# EAGLE schematic termostat_ETHERNET (EAGLE 9.0.1)
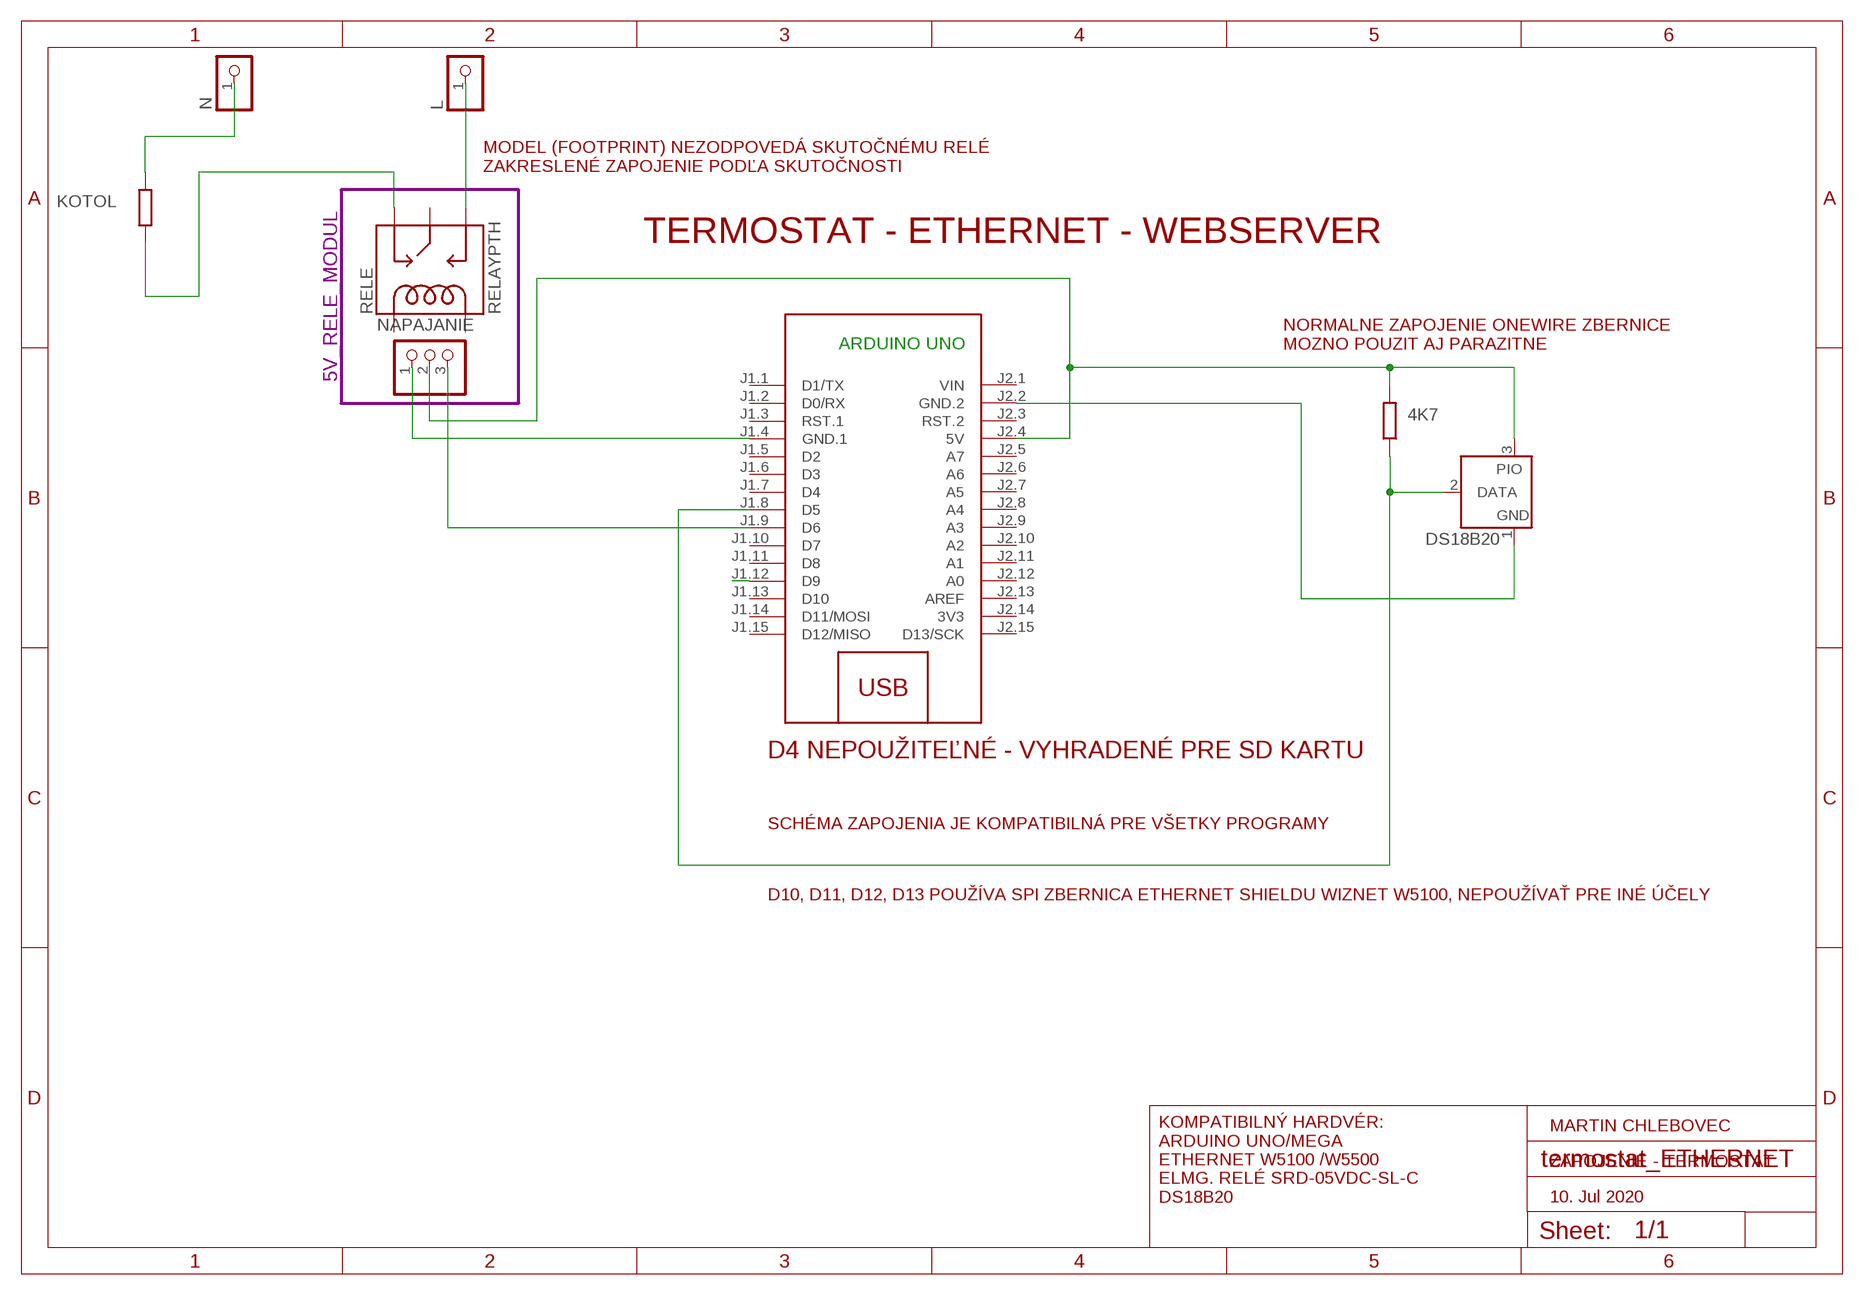
[diagram p0: schematic, sheet 1]

## Parts
IC1  DS2405  [TO92-]
L  PINHD-1X1CB  [1X01-CLEANBIG]
M1  ARDUINO-NANO-3.0  [ARDUINO-NANO-3.0]
N  PINHD-1X1CB  [1X01-CLEANBIG]
NAPAJANIE  PINHD-1X3  [1X03]
RELE  RELAYPTH  [SRD-05VDC-SL-C]

## Module instances
5V_RELE_MODUL = RELE

## Nets
N$3: IC1.1(GND) M1.J2.2(GND.2)
N$5: M1.J1.4(GND.1) NAPAJANIE.1
N$6: M1.J1.12(D9)
N$8: IC1.2(DATA) M1.J1.8(D5)
N$9: IC1.3(PIO) M1.J2.4(5V) NAPAJANIE.2
N$11: L.1 RELE.SWOPEN
N$12: N.1
N$13: RELE.SWCLOSED(SWCLOSE)
N$14: M1.J1.9(D6) NAPAJANIE.3
Unconnected: M1.J1.1(D1/TX) M1.J1.2(D0/RX) M1.J1.3(RST.1) M1.J1.5(D2) M1.J1.6(D3) M1.J1.7(D4) M1.J1.10(D7) M1.J1.11(D8) M1.J1.13(D10) M1.J1.14(D11/MOSI) M1.J1.15(D12/MISO) M1.J2.3(RST.2) M1.J2.5(A7) M1.J2.6(A6) M1.J2.7(A5) M1.J2.8(A4) M1.J2.9(A3) M1.J2.10(A2) M1.J2.11(A1) M1.J2.12(A0) M1.J2.13(AREF) M1.J2.15(D13/SCK) RELE.COIL0 RELE.COIL1 RELE.SWCOMMON

## Notes on the sheet
- MODEL (FOOTPRINT) NEZODPOVEDÁ SKUTOČNÉMU RELÉ
  ZAKRESLENÉ ZAPOJENIE PODĽA SKUTOČNOSTI
- KOTOL
- TERMOSTAT - ETHERNET - WEBSERVER
- ARDUINO UNO
- NORMALNE ZAPOJENIE ONEWIRE ZBERNICE
  MOZNO POUZIT AJ PARAZITNE
- 4K7
- DS18B20
- D4 NEPOUŽITEĽNÉ - VYHRADENÉ PRE SD KARTU
- SCHÉMA ZAPOJENIA JE KOMPATIBILNÁ PRE VŠETKY PROGRAMY
- D10, D11, D12, D13 POUŽÍVA SPI ZBERNICA ETHERNET SHIELDU WIZNET W5100, NEPOUŽÍVAŤ PRE INÉ ÚČELY
- MARTIN CHLEBOVEC
- ZAPOJENIE - TERMOSTAT
- KOMPATIBILNÝ HARDVÉR:
  ARDUINO UNO/MEGA
  ETHERNET W5100 /W5500
  ELMG. RELÉ SRD-05VDC-SL-C
  DS18B20
- 10. Jul 2020

## Power pins joined to a net without a drawn wire
3V3: M1.J2.14(3V3)
VIN: M1.J2.1(VIN)

## Library data of the parts
IC1 = maxim:DS2405: Addressable Switch DALLAS Semiconductor; MF: DALLAS SEMICONDUCTOR; MPN: DS2405; OC_FARNELL: 1188025; OC_NEWARK: 06F4645
L N = adafruit:PINHD-1X1: Pin header 1x1 for 0.1" spacing With round pins
M1 = diy-modules:ARDUINO-NANO-3.0: Arduino Nano 3.0 and compatible devices More details available here: https://www.arduino.cc/en/Main/ArduinoBoardNano Click here to find device on ebay.com <http://www.ebay.com/sch/arduino+nano>
NAPAJANIE = pinhead:PINHD-1X3: PIN HEADER
RELE = SRD-05VDC-SL-C:RELAY: SPDT relay (COM-00101)

## Module LCD
Ports: 

### Library data of the parts

## Module RELE
Ports: 

### Library data of the parts